# Altium project osciladorclapp.PrjPcb
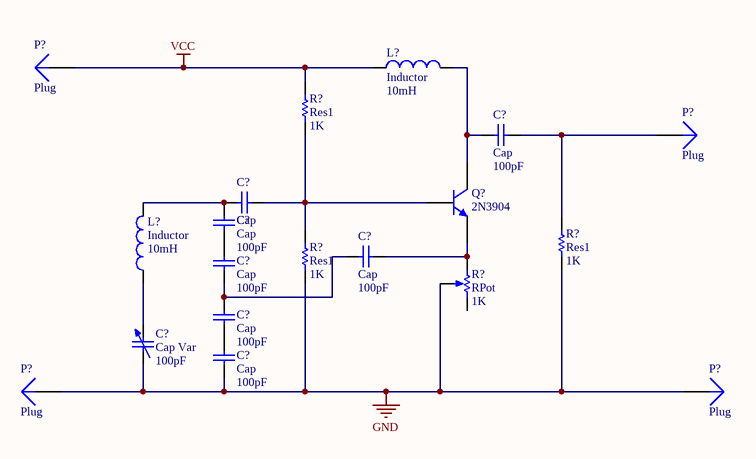
[diagram p0: Sheetclapp.SchDoc]
1 sheet, 19 parts. Net scope: global (net labels, ports and power ports of the same name join across sheets).
Board file: calpp7.PcbDoc

## Sheet Sheetclapp.SchDoc
size A4

### Parts
(Parts that share a designator on the sheet are numbered #1, #2 ... from top to bottom, then left to right.)
C?#1  Cap  value 100pF  [CAPR5-4X5]
C?#2  Cap  [CAPR5-4X5]
C?#3  Cap  value 100pF  [CAPR5-4X5]
C?#4  Cap  value 100pF  [CAPR5-4X5]
C?#5  Cap  value 100pF  [CAPR5-4X5]
C?#6  Cap  value 100pF  [CAPR5-4X5]
C?#7  Cap Var  value 100pF  [CAPR5-4X5]
C?#8  Cap  value 100pF  [CAPR5-4X5]
L?#1  Inductor  value 10mH  [RAD-0.3]
L?#2  Inductor  value 10mH  [RAD-0.3]
P?#1  Plug  [PIN1]
P?#2  Plug  [PIN1]
P?#3  Plug  [PIN1]
P?#4  Plug  [PIN1]
Q?  2N3904  [TO-92A]
R?#1  Res1  value 1K  [AXIAL-0.3]
R?#2  Res1  value 1K  [AXIAL-0.3]
R?#3  Res1  value 1K  [AXIAL-0.3]
R?#4  RPot  value 1K  [VR5]

### Nets
GND: C?#7.1 C?#8.1 P?#3.1 P?#4.1 R?#2.1 R?#3.1 R?#4.3(TAP)
VCC: L?#1.1 P?#1.1 R?#1.2
NetC?#1_1: C?#1.1 L?#1.2 Q?.3(C)
NetC?#1_2: C?#1.2 P?#2.1 R?#2.2
NetC?#2_1: C?#2.1 C?#3.2 L?#2.2
NetC?#2_2: C?#2.2 Q?.2(B) R?#1.1 R?#3.2
NetC?#3_1: C?#3.1 C?#5.2
NetC?#4_1: C?#4.1 C?#5.1 C?#6.2
NetC?#4_2: C?#4.2 Q?.1(E) R?#4.1(TOP)
NetC?#6_1: C?#6.1 C?#8.2
NetC?#7_2: C?#7.2 L?#2.1

Not connected (* = marked no-connect by the designer): R?#4 2(BOT)

### Library data of the parts
C?#1-C?#6 C?#8 = Cap: Capacitor; Published: 8-Jun-2000; LatestRevisionDate: 17-Jul-2002; LatestRevisionNote: Re-released for DXP Platform.; PackageReference: RAD-0.3; Publisher: Altium Limited; PackageDescription: Radial Cap, Thru-Hole; 2 Leads; 0.3 in Pin Spacing
C?#7 = Cap Var: Variable or Adjustable Capacitor; Published: 24-Mar-1999; LatestRevisionDate: 29-May-2009; LatestRevisionNote: IPC-7351 Footprint Added.; PackageReference: C1210; Publisher: Altium Limited; PackageDescription: Chip Capacitor 1210 Case Size; Code_JEITA: 1210; Code_IPC: CAPC3225
L?#1 L?#2 = Inductor: Code_IEC: 1005; Published: 8-Jun-2000; LatestRevisionDate: 29-May-2009; LatestRevisionNote: IPC-7351 Footprint Added.; PackageReference: 0402-A; Publisher: Altium Limited; PackageDescription: Chip Inductor; Code_JEITA: 0402
Q? = 2N3904: NPN General Purpose Amplifier; Published: 8-Jun-2000; LatestRevisionDate: 15-Jan-2003; LatestRevisionNote: PCB Footprint 'BCY-W3/D4.7' replaced; DatasheetVersion: 1997; PackageVersion: Sep-1998; PackageReference: TO-92A; Publisher: Altium Limited; PackageDescription: TO, Flat Index; 3 In-Line, Axial Leads; Body Dia. 4.5mm; Leads 0.51 x 0.48 mm (max); ComponentLink1Description: Manufacturer Link; ComponentLink1URL: http://www.fairchildsemi.com/; ComponentLink2Description: Datasheet; ComponentLink2URL: http://www.fairchildsemi.com/ds/2N%2F2N3904.pdf
R?#1-R?#3 = Res1: Resistor; Published: 8-Jun-2000; LatestRevisionDate: 17-Jul-2002; LatestRevisionNote: Re-released for DXP Platform.; PackageReference: AXIAL-0.3; Publisher: Altium Limited; PackageDescription: Axial Device, Thru-Hole; 2 Leads; 0.3 in Pin Spacing
R?#4 = RPot: Potentiometer; Sim Note: Enter the Resistance value and the set point into parameter fields.; Set Position: 0.5; Published: 8-Jun-2000; LatestRevisionDate: 17-Jul-2002; LatestRevisionNote: Re-released for DXP Platform.; PackageReference: VR5; Publisher: Altium Limited; PackageDescription: Variable Resistor, Thru-Hole; 3 Leads
P?#1-P?#4 = Plug: LatestRevisionDate: 17-Jul-2002; LatestRevisionNote: Re-released for DXP Platform.; Publisher: Altium Limited